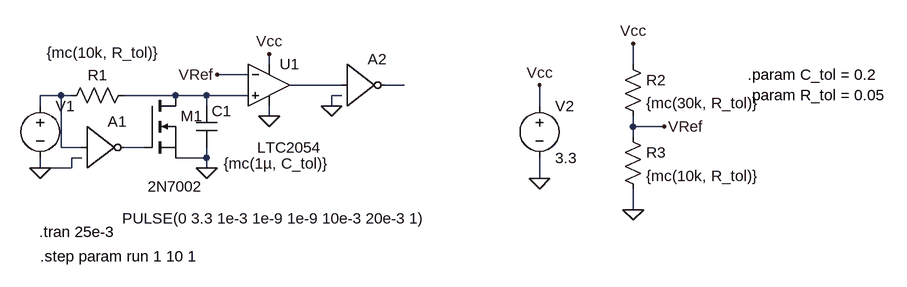
[diagram p0: schematic PulseLengthTrigger.asc]
PulseLengthTrigger.asc, the LTspice schematic file:
Version 4
SHEET 1 1212 680
WIRE 256 96 256 80
WIRE 816 96 816 64
WIRE 224 112 176 112
WIRE 368 128 288 128
WIRE 464 128 432 128
WIRE -64 144 -96 144
WIRE -48 144 -64 144
WIRE 112 144 32 144
WIRE 160 144 112 144
WIRE 224 144 160 144
WIRE 368 144 352 144
WIRE -96 160 -96 144
WIRE 160 160 160 144
WIRE 352 160 352 144
WIRE 672 160 672 128
WIRE 256 176 256 160
WIRE 816 192 816 176
WIRE 864 192 816 192
WIRE 816 208 816 192
WIRE -64 224 -64 144
WIRE -32 224 -64 224
WIRE 64 224 32 224
WIRE -32 240 -48 240
WIRE 160 240 160 224
WIRE 160 240 112 240
WIRE -96 256 -96 240
WIRE -48 256 -48 240
WIRE -48 256 -96 256
WIRE 160 256 160 240
WIRE 672 272 672 240
WIRE 816 320 816 288
FLAG -96 256 0
FLAG 160 256 0
FLAG 256 176 0
FLAG 672 272 0
FLAG 672 128 Vcc
FLAG 256 80 Vcc
FLAG 816 320 0
FLAG 864 192 VRef
FLAG 816 64 Vcc
FLAG 176 112 VRef
FLAG 352 160 0
SYMBOL cap 144 160 R0
WINDOW 3 42 89 Left 2
SYMATTR InstName C1
SYMATTR Value {mc(1µ, C_tol)}
SYMBOL res 48 128 R90
WINDOW 0 0 56 VBottom 2
WINDOW 3 -66 47 VTop 2
SYMATTR InstName R1
SYMATTR Value {mc(10k, R_tol)}
SYMBOL Opamps\\LTC2054 256 128 R0
WINDOW 3 -18 96 Left 2
SYMATTR InstName U1
SYMBOL voltage -96 144 R0
WINDOW 3 126 189 Left 2
WINDOW 123 0 0 Left 2
WINDOW 39 0 0 Left 2
SYMATTR InstName V1
SYMATTR Value PULSE(0 3.3 1e-3 1e-9 1e-9 10e-3 20e-3 1)
SYMBOL voltage 672 144 R0
SYMATTR InstName V2
SYMATTR Value 3.3
SYMBOL res 800 80 R0
SYMATTR InstName R2
SYMATTR Value {mc(30k, R_tol)}
SYMBOL res 800 192 R0
SYMATTR InstName R3
SYMATTR Value {mc(10k, R_tol)}
SYMBOL nmos 64 144 R0
WINDOW 3 5 140 Left 2
SYMATTR InstName M1
SYMATTR Value 2N7002
SYMBOL Digital\\inv -32 160 R0
SYMATTR InstName A1
SYMATTR SpiceLine2 Vhigh=3.3 Vlow=0
SYMBOL Digital\\inv 368 64 R0
SYMATTR InstName A2
SYMATTR SpiceLine2 Vhigh=3.3 Vlow=0
TEXT -98 354 Left 2 !.tran 25e-3
TEXT 992 112 Left 2 !.param C_tol = 0.2\n.param R_tol = 0.05
TEXT -96 392 Left 2 !.step param run 1 10 1

The netlist it stands for:
* PulseLengthTrigger.asc
C1 N004 0 {mc(1µ, C_tol)}
R1 N004 N003 {mc(10k, R_tol)}
XU1 N004 VRef N001 Vcc 0 LTC2054  ; pins In+ In- OUT V+ V-
V1 N003 0 PULSE(0 3.3 1e-3 1e-9 1e-9 10e-3 20e-3 1)
V2 Vcc 0 3.3
R2 Vcc VRef {mc(30k, R_tol)}
R3 VRef 0 {mc(10k, R_tol)}
M1 N004 N005 0 0 2N7002
A1 N003 0 0 0 0 N005 0 0 BUF Vhigh=3.3 Vlow=0
A2 N001 0 0 0 0 N002 0 0 BUF Vhigh=3.3 Vlow=0
.model NMOS NMOS
.model PMOS PMOS
.lib standard.mos
.tran 25e-3
.param C_tol = 0.2
.param R_tol = 0.05
.step param run 1 10 1
.lib LTC2.lib
.backanno
.end